# EAGLE schematic Board_1 (EAGLE 9.6.2)
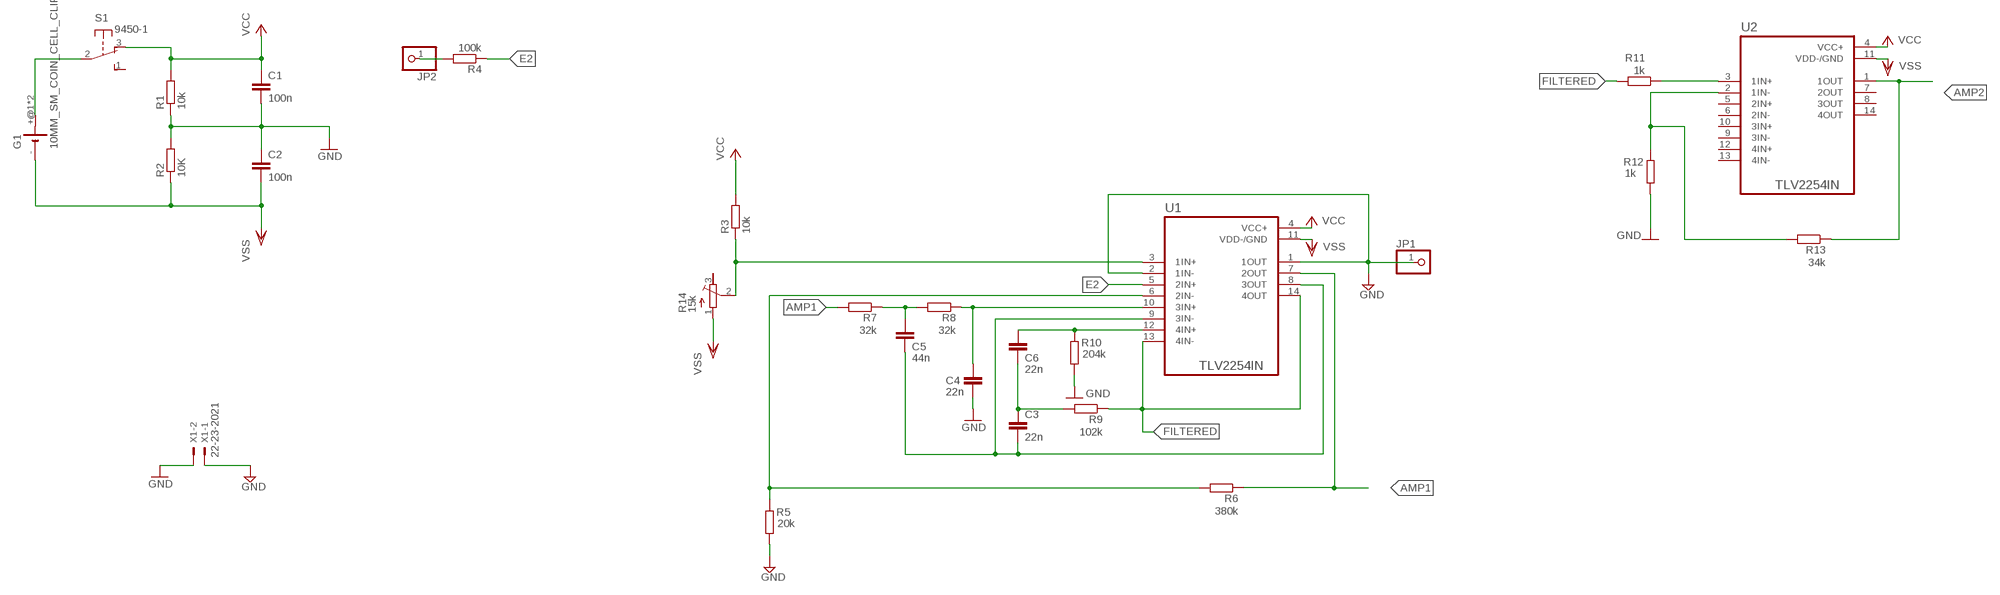
[diagram p0: schematic, sheet 1]

## Parts
C1  100n  C-EUC0805  [C0805]
C2  100n  C-EUC0805  [C0805]
C3  22n  C-EUC0805  [C0805]
C4  22n  C-EUC0805  [C0805]
C5  44n  C-EUC0805  [C0805]
C6  22n  C-EUC0805  [C0805]
G1  10MM_SM_COIN_CELL_CLIP  [10MM_SM_COIN_CELL_CLIP]
JP1  PINHD-1X1  [1X01]
JP2  PINHD-1X1  [1X01]
R1  10k  R-EU_R0805  [R0805]
R2  10K  R-EU_R0805  [R0805]
R3  10k  R-EU_R0805  [R0805]
R4  100k  R-EU_R0805  [R0805]
R5  20k  R-EU_R0805  [R0805]
R6  380k  R-EU_R0805  [R0805]
R7  32k  R-EU_R0805  [R0805]
R8  32k  R-EU_R0805  [R0805]
R9  102k  R-EU_R0805  [R0805]
R10  204k  R-EU_R0805  [R0805]
R11  1k  R-EU_R0805  [R0805]
R12  1k  R-EU_R0805  [R0805]
R13  34k  R-EU_R0805  [R0805]
R14  15k  R-TRIMM4G/J  [RTRIM4G/J]
S1  9450-1  [9450-1]
U1  TLV2254IN  [DIP794W45P254L1969H508Q14]
U2  TLV2254IN  [DIP794W45P254L1969H508Q14]
X1  22-23-2021  [22-23-2021]

## Nets
AMP1: R6.1 R7.2 U1.7(2OUT)
AMP2: R13.1 U2.1(1OUT)
E1: R3.1 R14.2(S) U1.3(1IN+)
E2: R4.1 U1.5(2IN+)
FILTERED: R9.1 R11.2 U1.13(4IN-) U1.14(4OUT)
GND: C1.2 C2.1 C4.2 JP1.1 R1.1 R2.2 R5.2 R10.2 R12.2 U1.1(1OUT) U1.2(1IN-) X1.1 X1.2
N$1: JP2.1 R4.2
N$2: C3.1 C6.2 R9.2
N$3: C3.2 C5.2 U1.8(3OUT) U1.9(3IN-)
N$4: R5.1 R6.2 U1.6(2IN-)
N$5: G1.+@1(+) G1.+@2(+) S1.2(P)
N$6: C5.1 R7.1 R8.2
N$7: C4.1 R8.1 U1.10(3IN+)
N$8: C6.1 R10.1 U1.12(4IN+)
N$9: R11.1 U2.3(1IN+)
N$12: R12.1 R13.2 U2.2(1IN-)
VCC: C1.1 R1.2 R3.2 S1.3(O) U1.4(VCC+) U2.4(VCC+)
VSS: C2.2 G1.- R2.1 R14.1(A) U1.11(VDD-/GND) U2.11(VDD-/GND)
Unconnected: R14.3(E) S1.1(S) U2.5(2IN+) U2.6(2IN-) U2.7(2OUT) U2.8(3OUT) U2.9(3IN-) U2.10(3IN+) U2.12(4IN+) U2.13(4IN-) U2.14(4OUT)

## Library data of the parts
C1-C6 = rcl:C-EU: CAPACITOR, European symbol; SPICEPREFIX: C
G1 = battery:10MM_SM_COIN_CELL_CLIP: Battery cell clip for CR927 Source: KEYSTONE ELECTRONICS CORP. www.keyelco.com, ASTORIA, N.Y. 11105-2017 PART ANME 10mm SM COIN CELl CLIP DWG NO. 3030
JP1 JP2 = pinhead:PINHD-1X1: PIN HEADER
R1-R13 = rcl:R-EU_: RESISTOR, European symbol; SPICEPREFIX: R
R14 = rcl:R-TRIMM: Trimm resistor; SPICEMODEL: X; SPICEPREFIXL: POT
S1 = switch-misc:9450-1: MARQUARDT SWITCH
U1 U2 = TLV2254IN:TLV2254IN: Check prices <https://pricing.snapeda.com/parts/TLV2254IN/Texas%20Instruments/view-part?ref=eda>; AVAILABILITY: Warning; DESCRIPTION: Advanced LinCMOS&trade; rail-to-rail very low-power quad operational amplifier 14-PDIP -40 to 125; MF: Texas Instruments; MP: TLV2254IN; PACKAGE: PDIP-14 Texas Instruments; PRICE: None; PURCHASE-URL: https://pricing.snapeda.com/search/part/TLV2254IN/?ref=eda
X1 = con-molex:22-23-2021: .100" (2.54mm) Center Header - 2 Pin; MF: MOLEX; MPN: 22-23-2021; OC_FARNELL: 1462926; OC_NEWARK: 25C3832